# EAGLE design SkateMate_Receiver (EAGLE 8.1.0)
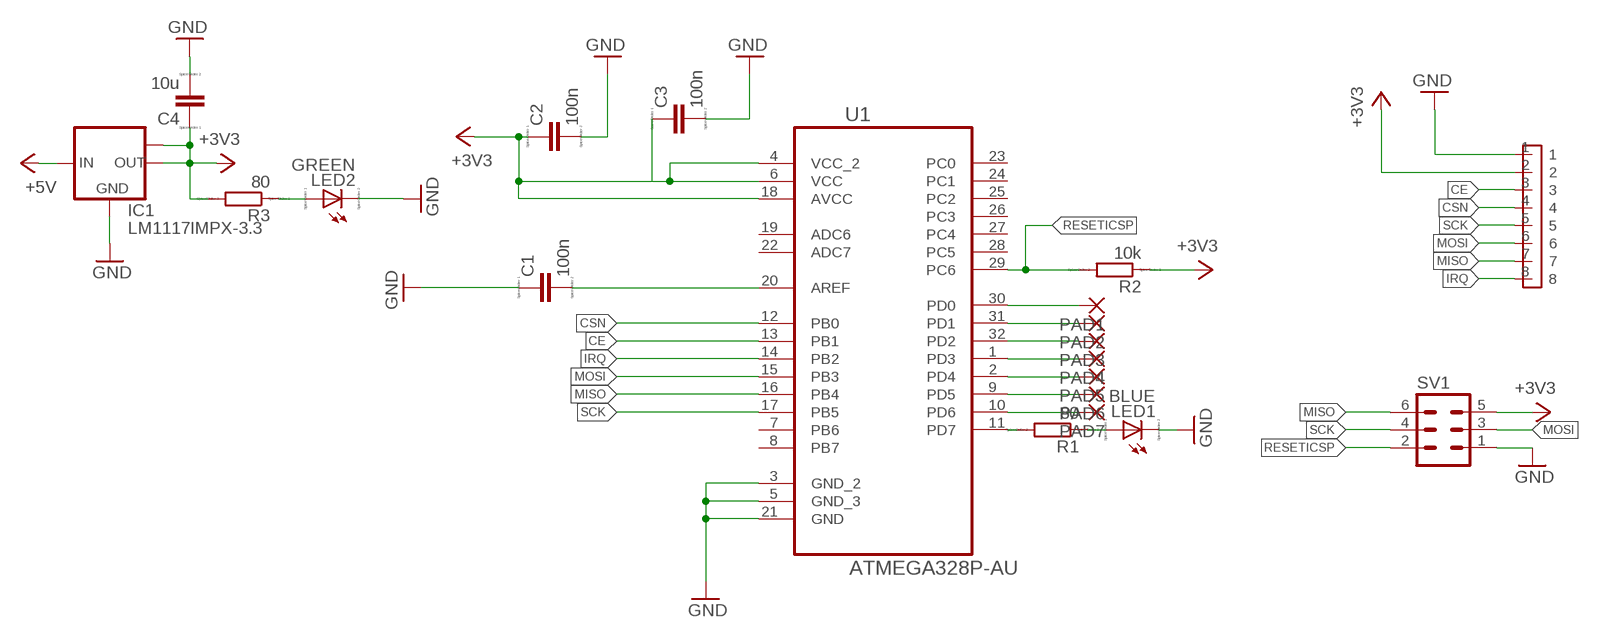
[diagram p0: schematic, sheet 1]

## Parts
C1  100n  CC0603  [C0603]
C2  100n  CC0603  [C0603]
C3  100n  CC0603  [C0603]
C4  10u  CC0603  [C0603]
IC1  LM1117IMPX-3.3  [SOT223]
LED1  BLUE  LED_ESML0603  [LED_SML0603]
LED2  GREEN  LED_ESML0603  [LED_SML0603]
PAD1  1,6/0,8  [1,6/0,8]
PAD2  1,6/0,8  [1,6/0,8]
PAD3  1,6/0,8  [1,6/0,8]
PAD4  1,6/0,8  [1,6/0,8]
PAD5  1,6/0,8  [1,6/0,8]
PAD6  1,6/0,8  [1,6/0,8]
PAD7  1,6/0,8  [1,6/0,8]
R1  80  RR0603  [R0603]
R2  10k  RR0603  [R0603]
R3  80  RR0603  [R0603]
SV1  MA03-2  [MA03-2]
U1  ATMEGA328P-AU  [QFP80P900X900X120-32N]
U$1  HEADER1,27  [HEADER1,27]

## Nets
+3V3: C2.1 C3.1 C4.1 IC1.2(OUT) IC1.TAB(OUT1) R2.1 R3.2 SV1.5 U1.4(VCC_2) U1.6(VCC) U1.18(AVCC) U$1.2
+5V: IC1.3(IN)
CE: U1.13(PB1) U$1.3
CSN: U1.12(PB0) U$1.4
GND: C1.1 C2.2 C3.2 C4.2 IC1.1(GND) LED1.C LED2.C SV1.1 U1.3(GND_2) U1.5(GND_3) U1.21(GND) U$1.1
IRQ: U1.14(PB2) U$1.8
MISO: SV1.6 U1.16(PB4) U$1.7
MOSI: SV1.3 U1.15(PB3) U$1.6
N$1: R1.2 U1.11(PD7)
N$2: LED1.A R1.1
N$3: PAD1.1(P) U1.30(PD0)
N$4: PAD2.1(P) U1.31(PD1)
N$5: PAD3.1(P) U1.32(PD2)
N$6: PAD4.1(P) U1.1(PD3)
N$7: PAD5.1(P) U1.2(PD4)
N$8: C1.2 U1.20(AREF)
N$9: PAD6.1(P) U1.9(PD5)
N$10: PAD7.1(P) U1.10(PD6)
N$11: LED2.A R3.1
RESETICSP: R2.2 SV1.2 U1.29(PC6)
SCK: SV1.4 U1.17(PB5) U$1.5
Unconnected: U1.7(PB6) U1.8(PB7) U1.19(ADC6) U1.22(ADC7) U1.23(PC0) U1.24(PC1) U1.25(PC2) U1.26(PC3) U1.27(PC4) U1.28(PC5)

## Library data of the parts
C1-C4 = eagle-ltspice:C: CAPACITOR, European symbol; SPICEMODEL: NONE; SPICEPREFIX: C
IC1 = lm1117:LM1117IMPX-*
LED1 LED2 = eagle-ltspice:LED_E: LED Source: http://www.osram.convergy.de Source: www.luxeon.com Source: www.kingbright.com; SPICEMODEL: NONE; SPICEPREFIX: D; SPICETYPE: diode
PAD1-PAD7 = wirepad:1,6/0,8: THROUGH-HOLE PAD
R1-R3 = eagle-ltspice:R: RESISTOR, European symbol; SPICEMODEL: NONE; SPICEPREFIX: R
SV1 = con-lstb:MA03-2: PIN HEADER; OC_FARNELL: unknown; OC_NEWARK: unknown
U1 = Atmel_By_element14_Batch_1-00:ATMEGA328P-AU: 8-bit Microcontroller with In-System Programmable Flash; MPN: ATMEGA328P-AU; OC_FARNELL: 1715486; OC_NEWARK: 14R4631; PACKAGE: TQFP-32; SUPPLIER: Atmel
U$1 = SkateMateMagicGlove:HEADER1,27

## Board
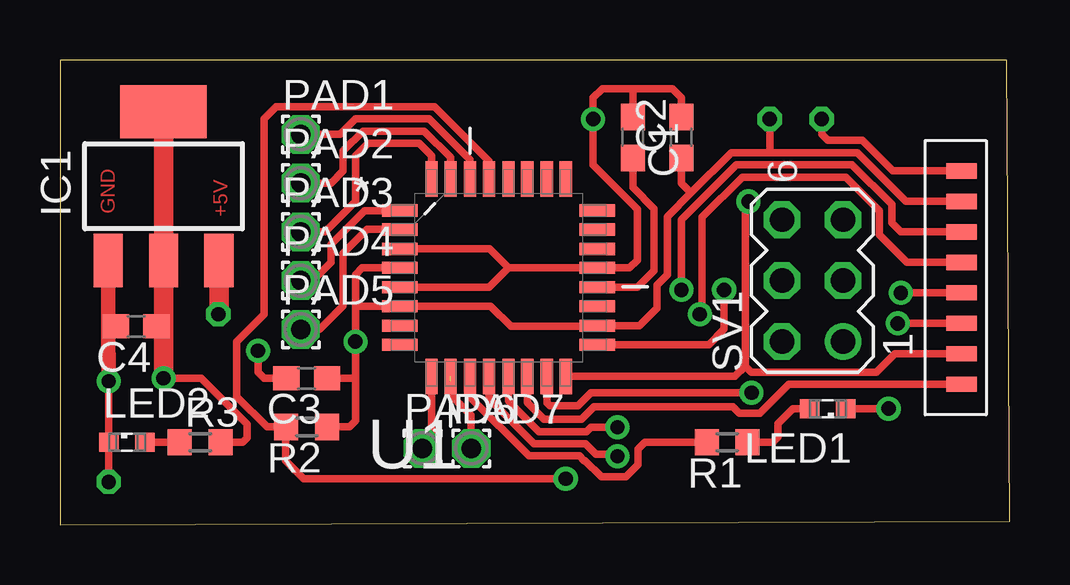
[diagram p1: board, top side]
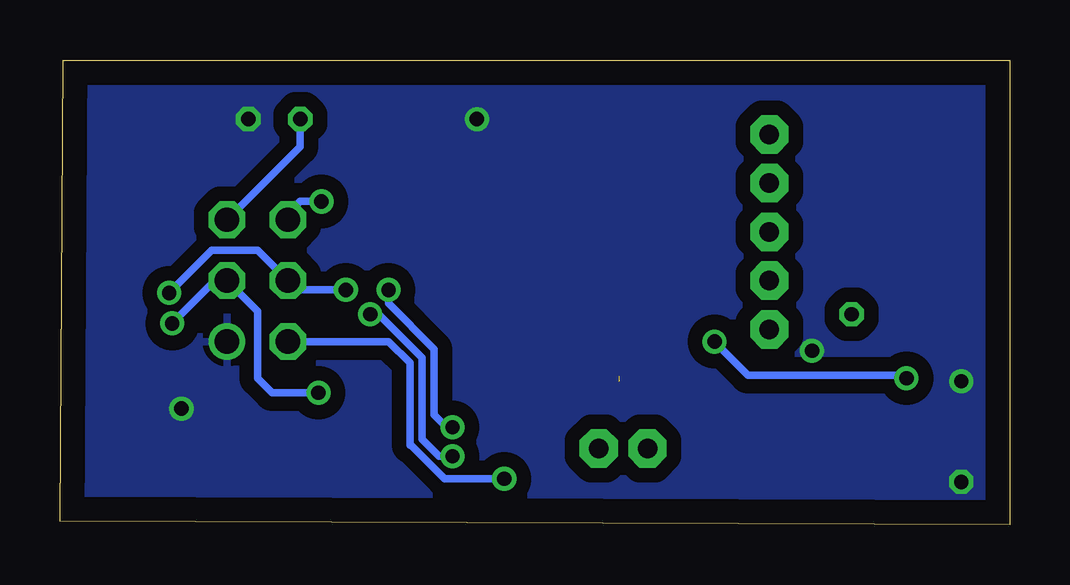
[diagram p2: board, bottom side, seen from below]

Size 39.6 x 19.36 mm. Coordinates in mm from the lower left corner, seen from the top.
Outline: 0,0 39.6,0.13 39.48,19.36 0,19.36 0,0
Copper layers (1*16): Top 0.035mm / dielectric 1.5mm / Bottom 0.035mm
Design rules "default *": minimum track width 0.3mm, minimum drill 0.5mm, track to track 8mil, track to pad 8mil, pad to pad 8mil, via to via 8mil, smd to smd 8mil, copper to edge 40mil, drill to drill 8mil, minimum pad ring 10mil, minimum via ring 8mil, stop-mask expansion 4mil, vias tented up to drill 0mil, thermal gap 10mil

### Footprints (pad centres in the part's own frame; a part is rotated, then mirrored left to right if it is on the bottom)
C0603 = smd 1.1 x 1: 1 -0.85,0; 2 0.85,0
SOT223 = smd 1.219 x 2.235: 1 -2.311,-3.099; 2 0,-3.099; 3 2.311,-3.099 | smd 3.6 x 2.2: TAB 0,3.099
LED_SML0603 = smd 0.8 x 0.8: A 0.75,0; C -0.75,0
1,6/0,8 = drill 0.813 pad 1.6 octagon: 1 0,0
R0603 = smd 1 x 1.1: 1 -0.85,0; 2 0.85,0
MA03-2 = drill 1.016: 1 -2.54,-1.27 | drill 1.016 octagon: 2 -2.54,1.27; 3 0,-1.27; 4 0,1.27; 5 2.54,-1.27; 6 2.54,1.27
QFP80P900X900X120-32N = smd 1.473 x 0.508: 1 -4.115,2.794; 2 -4.115,2.007; 3 -4.115,1.194; 4 -4.115,0.406; 5 -4.115,-0.406; 6 -4.115,-1.194; 7 -4.115,-2.007; 8 -4.115,-2.794; 17 4.115,-2.794; 18 4.115,-2.007; 19 4.115,-1.194; 20 4.115,-0.406; 21 4.115,0.406; 22 4.115,1.194; 23 4.115,2.007; 24 4.115,2.794 | smd 0.508 x 1.473: 9 -2.794,-4.115; 10 -2.007,-4.115; 11 -1.194,-4.115; 12 -0.406,-4.115; 13 0.406,-4.115; 14 1.194,-4.115; 15 2.007,-4.115; 16 2.794,-4.115; 25 2.794,4.115; 26 2.007,4.115; 27 1.194,4.115; 28 0.406,4.115; 29 -0.406,4.115; 30 -1.194,4.115; 31 -2.007,4.115; 32 -2.794,4.115
HEADER1,27 = smd 1.27 x 0.635: 1 -1.016,4.445; 2 -1.016,3.175; 3 -1.016,1.905; 4 -1.016,0.635; 5 -1.016,-0.635; 6 -1.016,-1.905; 7 -1.016,-3.175; 8 -1.016,-4.445

### Placement (x,y rotation side)
C1  23.88,16.13 270 top
C2  25.91,16.13 90 top
C3  10.29,6.1 180 top
C4  3.17,8.26 180 top
IC1  4.32,14.1 0 top
LED1  32,4.83 180 top
LED2  2.79,3.43 0 top
PAD1  10.03,16.26 0 top
PAD2  10.03,14.22 0 top
PAD3  10.03,12.19 0 top
PAD4  10.03,10.16 0 top
PAD5  10.03,8.13 0 top
PAD6  15.11,3.17 0 top
PAD7  17.14,3.17 0 top
R1  27.81,3.43 180 top
R2  10.29,4.06 180 top
R3  5.84,3.43 0 top
SV1  31.37,10.16 90 top
U1  18.29,10.29 0 top
U$1  38.61,10.29 0 top

### Tracks (layer width: path | path; a pad name or v marks a point on that pad's centre or on a via)
+3V3  (via drill 0.6 pad 0.41, 0.6 pad 1.02)
  Top 0.305: 29.59,15.49 33.23,15.49 35.26,13.46 U$1.2 | 29.59,15.49 27.98,15.49 26.31,13.82 | 29.59,15.49 v29.59,16.89 | R2.1 12.06,4.06 12.32,4.32 12.32,6.1 | 12.32,6.1 v12.32,7.62 12.32,9.09 | C3.1 12.32,6.1 | 13.11,10.69 U1.4 12.6,10.69 12.32,10.41 12.32,9.09 | 12.32,9.09 U1.6 17.96,9.09 18.8,8.26 22.38,8.26 U1.18 24.16,8.28 24.89,9.02 24.89,9.98 25.32,10.4 25.32,12.83 26.31,13.82 | C2.1 25.91,14.22 26.31,13.82 | C4.1 4.19,8.26 4.32,8.13 | v4.32,6.1 5.89,6.1 7.81,4.17 7.81,3.62 7.62,3.43 R3.2
  Top 0.813: v4.32,6.1 4.32,8.13 IC1.2 IC1.TAB
  Bottom 0.305: v29.59,16.89 29.59,15.75 SV1.5 | v12.32,7.62 10.92,6.22 4.45,6.22 v4.32,6.1
+5V  (via drill 0.6 pad 0.81)
  Top 0.813: IC1.3 6.63,8.79 v6.6,8.76
CE  (via drill 0.6, 0.6 pad 0.41)
  Top 0.305: U$1.3 35.05,12.19 34.67,12.57 34.67,13.34 33.02,14.99 28.19,14.99 25.91,12.7 v25.91,9.78 | v23.24,4.05 22.13,4.05 21.95,3.87 19.97,3.87 18.97,4.87 | 18.97,4.87 18.87,4.97 | U1.13 18.69,5.15 18.97,4.87
  Bottom 0.305: v25.91,9.78 25.91,9.22 24,7.31 24,4.57 23.48,4.05 v23.24,4.05
CSN  (via drill 0.6, 0.6 pad 0.41)
  Top 0.305: U$1.4 35.31,10.92 34.16,12.06 34.16,13.08 32.77,14.48 28.45,14.48 26.77,12.8 26.77,8.86 v26.67,8.76 | v23.24,2.84 23.16,2.92 22.35,2.92 21.91,3.37 19.76,3.37 17.88,5.24 U1.12
  Bottom 0.305: v26.67,8.76 26.33,8.76 24.51,6.94 24.51,3.56 23.8,2.84 v23.24,2.84
GND  (via drill 0.6, 0.6 pad 0.41, 0.6 pad 1.02)
  Top 0.305: U1.5 17.88,9.88 18.69,10.69 | 18.69,10.69 U1.21 23.75,10.69 24.07,11.01 24.07,13.14 22.23,14.99 v22.23,16.89 22.23,17.78 22.61,18.16 23.88,18.16 | U1.3 17.91,11.48 18.69,10.69 | C2.2 25.91,17.78 25.53,18.16 23.88,18.16 | U$1.1 34.71,14.73 33.44,16 32,16 31.75,16.26 v31.75,16.89 | LED1.C v34.54,4.83 | C3.2 8.51,6.1 8.26,6.35 v8.26,7.24 | C4.2 2.14,8.26 2.01,8.38 | C1.1 23.88,18.16 | v2.03,5.97 2.03,3.44 LED2.C v2.03,1.78
  Top 0.61: IC1.1 2.01,8.79 2.01,8.38 v2.03,5.97
  pour Bottom (isolate 0.61): 0.38,19.05 39.12,18.92 39.37,0.38 0.38,0.51
IRQ
  Top 0.305: 35.69,5.84 U$1.8 30.39,5.84 29.18,4.63 28.32,4.63 28.04,4.91 22.27,4.91 21.74,4.38 20.18,4.38 19.48,5.08 U1.14
MISO  (via drill 0.6)
  Top 0.305: U$1.7 34.8,7.11 34.04,6.35 28.83,6.35 28.57,6.6 | 28.57,6.6 28.57,13.34 v28.7,13.46 | U1.16 28.14,6.17 28.57,6.6
  Bottom 0.305: SV1.6 30.1,12.95 29.59,13.46 v28.7,13.46
MOSI  (via drill 0.6, 0.6 pad 0.41)
  Top 0.305: U1.15 20.3,5.08 20.42,4.95 21.59,4.95 22.13,5.49 v28.83,5.49 | v34.92,8.38 U$1.6
  Bottom 0.305: v34.92,8.38 33.15,10.16 SV1.3 31.37,8.89 31.37,6.1 30.76,5.49 v28.83,5.49
N$1
  Top 0.305: R1.2 24.38,3.43 24.1,3.15 24.1,2.49 23.6,1.98 22.57,1.98 21.89,2.67 21.84,2.67 21.65,2.86 19.55,2.86 17.09,5.31 U1.11
N$2
  Top 0.305: R1.1 29.72,3.43 29.92,3.63 29.92,4.19 30.56,4.83 LED1.A
N$3
  Top 0.305: U1.30 17.09,15.2 15.39,16.9 12.33,16.9 11.68,16.26 PAD1.1
N$4
  Top 0.305: U1.31 16.28,15.3 15.18,16.4 12.63,16.4 11.81,15.58 11.81,14.73 11.3,14.22 PAD2.1
N$5
  Top 0.305: U1.32 15.49,15.37 14.97,15.89 12.84,15.89 12.32,15.37 12.32,13.46 11.05,12.19 PAD3.1
N$6
  Top 0.305: U1.1 12.7,13.08 11.3,11.68 11.3,10.92 10.54,10.16 PAD4.1
N$7
  Top 0.305: U1.2 12.8,12.29 11.81,11.3 11.81,9.12 10.82,8.13 PAD5.1
N$8
  Top 0.305: U1.20 24.08,9.88 24.77,10.57 24.77,13.16 23.88,14.05 C1.2
N$9
  Top 0.305: U1.9 15.49,3.56 PAD6.1
N$10  (1 unrouted)
  Top 0.305: 16.26,5.94 16.28,5.97 16.28,5.41 17.13,4.56 17.13,3.19 PAD7.1
N$11
  Top 0.305: LED2.A R3.1
RESETICSP  (via drill 0.6)
  Top 0.305: U1.29 17.88,15.13 15.61,17.41 9,17.41 8.51,16.92 8.51,8.76 7.37,7.62 7.37,5.33 8.64,4.06 R2.2 9.4,4.03 9.4,2.67 10.16,1.91 v21.08,1.91
  Bottom 0.305: SV1.2 25.91,7.62 25.02,6.73 25.02,3.3 24.98,3.3 23.58,1.91 v21.08,1.91
SCK  (via drill 0.6)
  Top 0.305: v35.05,9.65 U$1.5 | v27.69,9.78 27.69,8.13 27.05,7.49 U1.17
  Bottom 0.305: v27.69,9.78 29.72,9.78 SV1.4 31.37,11.43 33.27,11.43 v35.05,9.65

### Text on the board
Top: GND | +5V